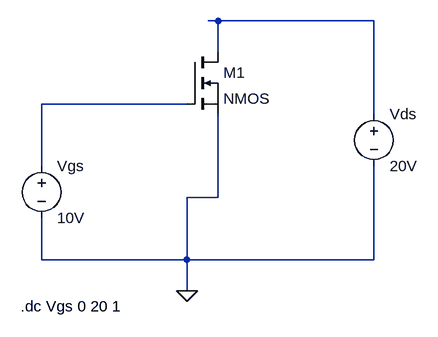
[diagram p0: schematic 8 Mosfet characteristics.asc]
8 Mosfet characteristics.asc, the LTspice schematic file:
Version 4
SHEET 1 880 680
WIRE 304 -80 288 -80
WIRE 544 -80 304 -80
WIRE 304 -32 304 -80
WIRE 256 48 32 48
WIRE 544 64 544 -80
WIRE 32 144 32 48
WIRE 304 192 304 64
WIRE 304 192 256 192
WIRE 32 288 32 224
WIRE 256 288 256 192
WIRE 256 288 32 288
WIRE 544 288 544 144
WIRE 544 288 256 288
WIRE 256 336 256 288
FLAG 256 336 0
SYMBOL voltage 32 128 R0
WINDOW 123 0 0 Left 0
WINDOW 39 0 0 Left 0
SYMATTR InstName Vgs
SYMATTR Value 10V
SYMBOL voltage 544 48 R0
WINDOW 123 0 0 Left 0
WINDOW 39 0 0 Left 0
SYMATTR InstName Vds
SYMATTR Value 20V
SYMBOL nmos 256 -32 R0
SYMATTR InstName M1
TEXT 0 360 Left 2 !.dc Vgs 0 20 1

The netlist it stands for:
* 8 Mosfet characteristics.asc
Vgs N002 0 10V
Vds N001 0 20V
M1 N001 N002 0 0 NMOS
.model NMOS NMOS
.model PMOS PMOS
.lib standard.mos
.dc Vgs 0 20 1
.backanno
.end

* Results of the author's LTspice run, read from the files saved beside the schematic
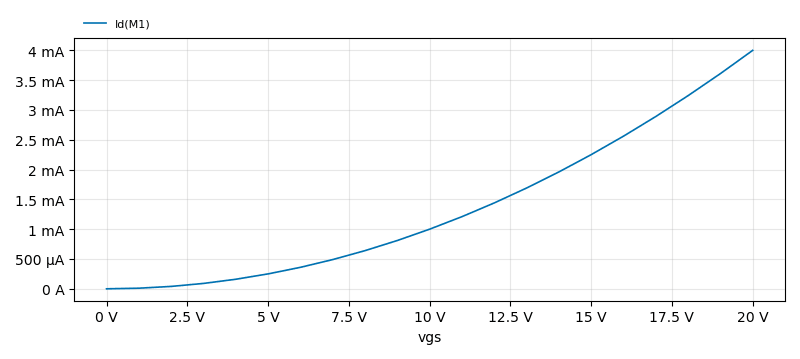
[diagram p1: DC transfer characteristic of 8 Mosfet characteristics.asc, plotted from the saved traces]
* DC transfer characteristic, 1 run:
*   Id(M1): 40.01 pA at vgs=0 V, 4 mA at vgs=20 V, min 40.01 pA, max 4 mA